# EAGLE schematic Wuefelseite_1D (EAGLE 7.6.0)
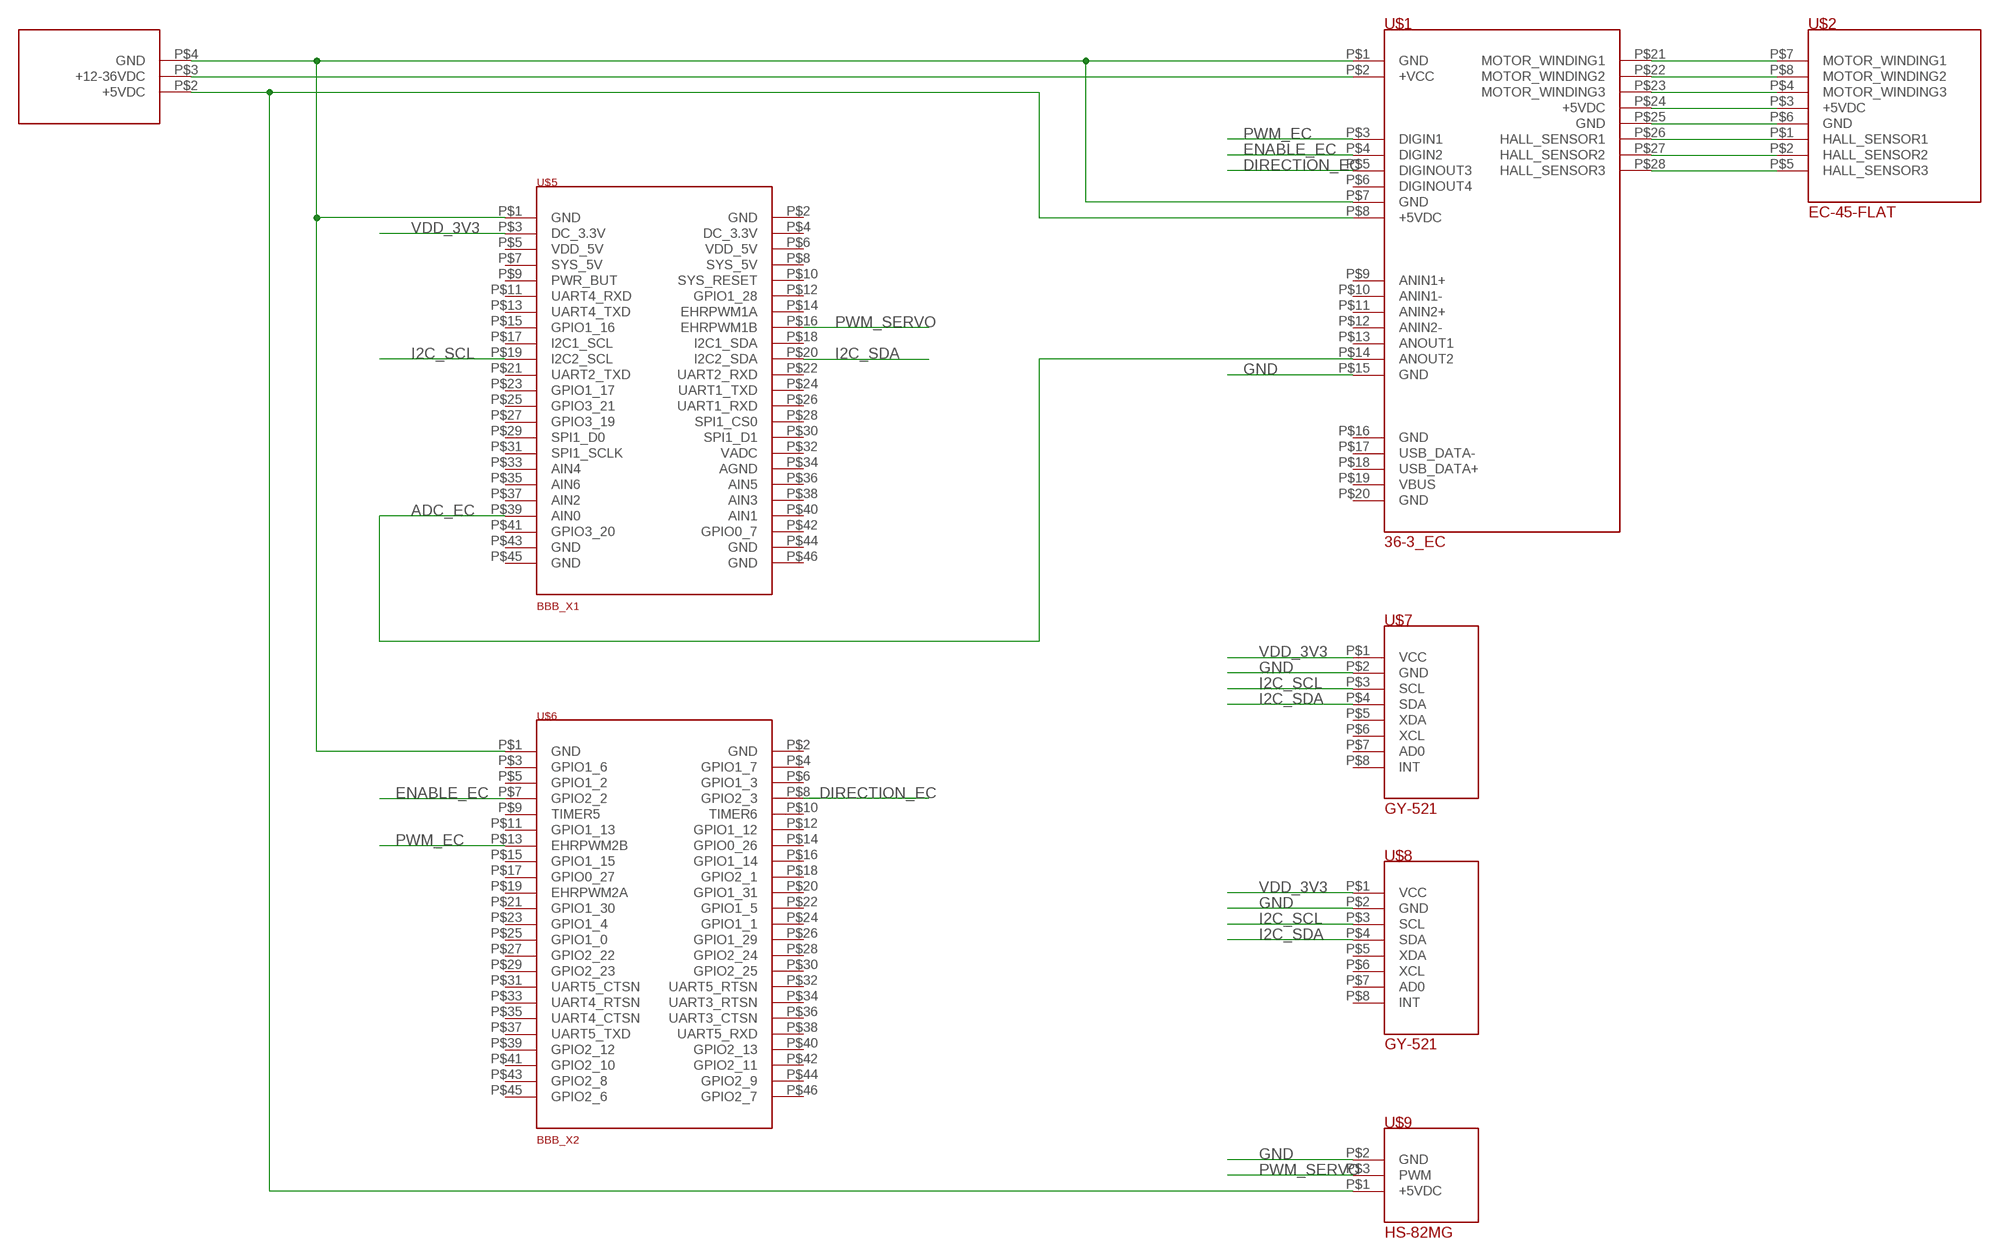
[diagram p0: schematic, sheet 1]

## Parts
U$1  36-3_EC  [36-3_EC]
U$2  EC-45-FLAT  [EC-45-FLAT]
U$5  BBB_X1  BEAGLEBONE  [BEAGLEBONE]
U$6  BBB_X2  BEAGLEBONE  [BEAGLEBONE]
U$7  GY-521  [GY-521]
U$8  GY-521  [GY-521]
U$9  HS-82MG  [HS-82MG]
U$10  POWER_SUPPLY  [POWER_SUPPLY]

## Nets
ADC_EC: U$1.P$14(ANOUT2) U$5.P$39(AIN0)
DIRECTION_EC: U$1.P$5(DIGINOUT3) U$6.P$8(GPIO2_3)
ENABLE_EC: U$1.P$4(DIGIN2) U$6.P$7(GPIO2_2)
GND: U$1.P$1(GND) U$1.P$7(GND) U$1.P$15(GND) U$5.P$1(GND) U$6.P$1(GND) U$7.P$2(GND) U$8.P$2(GND) U$9.P$2(GND) U$10.P$4(GND)
I2C_SCL: U$5.P$19(I2C2_SCL) U$7.P$3(SCL) U$8.P$3(SCL)
I2C_SDA: U$5.P$20(I2C2_SDA) U$7.P$4(SDA) U$8.P$4(SDA)
N$1: U$1.P$21(MOTOR_WINDING1) U$2.P$7(MOTOR_WINDING1)
N$2: U$1.P$22(MOTOR_WINDING2) U$2.P$8(MOTOR_WINDING2)
N$3: U$1.P$23(MOTOR_WINDING3) U$2.P$4(MOTOR_WINDING3)
N$4: U$1.P$24(+5VDC) U$2.P$3(+5VDC)
N$5: U$1.P$25(GND) U$2.P$6(GND)
N$6: U$1.P$26(HALL_SENSOR1) U$2.P$1(HALL_SENSOR1)
N$7: U$1.P$27(HALL_SENSOR2) U$2.P$2(HALL_SENSOR2)
N$8: U$1.P$28(HALL_SENSOR3) U$2.P$5(HALL_SENSOR3)
N$12: U$1.P$8(+5VDC) U$9.P$1(+5VDC) U$10.P$2(+5VDC)
N$18: U$1.P$2(+VCC) U$10.P$3(+12-36VDC)
PWM_EC: U$1.P$3(DIGIN1) U$6.P$13(EHRPWM2B)
PWM_SERVO: U$5.P$16(EHRPWM1B) U$9.P$3(PWM)
VDD_3V3: U$5.P$3(DC_3.3V) U$8.P$1(VCC)
Unconnected: U$1.P$6(DIGINOUT4) U$1.P$9(ANIN1+) U$1.P$10(ANIN1-) U$1.P$11(ANIN2+) U$1.P$12(ANIN2-) U$1.P$13(ANOUT1) U$1.P$16(GND) U$1.P$17(USB_DATA-) U$1.P$18(USB_DATA+) U$1.P$19(VBUS) U$1.P$20(GND) U$5.P$2(GND) U$5.P$4(DC_3.3V) U$5.P$5(VDD_5V) U$5.P$6(VDD_5V) U$5.P$7(SYS_5V) U$5.P$8(SYS_5V) U$5.P$9(PWR_BUT) U$5.P$10(SYS_RESET) U$5.P$11(UART4_RXD) U$5.P$12(GPIO1_28) U$5.P$13(UART4_TXD) U$5.P$14(EHRPWM1A) U$5.P$15(GPIO1_16) U$5.P$17(I2C1_SCL) U$5.P$18(I2C1_SDA) U$5.P$21(UART2_TXD) U$5.P$22(UART2_RXD) U$5.P$23(GPIO1_17) U$5.P$24(UART1_TXD) U$5.P$25(GPIO3_21) U$5.P$26(UART1_RXD) U$5.P$27(GPIO3_19) U$5.P$28(SPI1_CS0) U$5.P$29(SPI1_D0) U$5.P$30(SPI1_D1) U$5.P$31(SPI1_SCLK) U$5.P$32(VADC) U$5.P$33(AIN4) U$5.P$34(AGND) U$5.P$35(AIN6) U$5.P$36(AIN5) U$5.P$37(AIN2) U$5.P$38(AIN3) U$5.P$40(AIN1) U$5.P$41(GPIO3_20) U$5.P$42(GPIO0_7) U$5.P$43(GND) U$5.P$44(GND) U$5.P$45(GND) U$5.P$46(GND) U$6.P$2(GND) U$6.P$3(GPIO1_6) U$6.P$4(GPIO1_7) U$6.P$5(GPIO1_2) U$6.P$6(GPIO1_3) U$6.P$9(TIMER5) U$6.P$10(TIMER6) U$6.P$11(GPIO1_13) U$6.P$12(GPIO1_12) U$6.P$14(GPIO0_26) U$6.P$15(GPIO1_15) U$6.P$16(GPIO1_14) U$6.P$17(GPIO0_27) U$6.P$18(GPIO2_1) U$6.P$19(EHRPWM2A) U$6.P$20(GPIO1_31) U$6.P$21(GPIO1_30) U$6.P$22(GPIO1_5) U$6.P$23(GPIO1_4) U$6.P$24(GPIO1_1) U$6.P$25(GPIO1_0) U$6.P$26(GPIO1_29) U$6.P$27(GPIO2_22) U$6.P$28(GPIO2_24) U$6.P$29(GPIO2_23) U$6.P$30(GPIO2_25) U$6.P$31(UART5_CTSN) U$6.P$32(UART5_RTSN) U$6.P$33(UART4_RTSN) U$6.P$34(UART3_RTSN) U$6.P$35(UART4_CTSN) U$6.P$36(UART3_CTSN) U$6.P$37(UART5_TXD) U$6.P$38(UART5_RXD) U$6.P$39(GPIO2_12) U$6.P$40(GPIO2_13) U$6.P$41(GPIO2_10) U$6.P$42(GPIO2_11) U$6.P$43(GPIO2_8) U$6.P$44(GPIO2_9) U$6.P$45(GPIO2_6) U$6.P$46(GPIO2_7) U$7.P$1(VCC) U$7.P$5(XDA) U$7.P$6(XCL) U$7.P$7(AD0) U$7.P$8(INT) U$8.P$5(XDA) U$8.P$6(XCL) U$8.P$7(AD0) U$8.P$8(INT)

## Library data of the parts
U$1 = 36-3-EC:36-3_EC
U$2 = EC-45-flat:EC-45-FLAT
U$5 = BeagleBoneBlack:BEAGLEBONE
U$6 = BeagleBoneBlack2:BEAGLEBONE
U$7 U$8 = GY-521:GY-521
U$9 = HS-82MG:HS-82MG
U$10 = POWER_SUPPLY:POWER_SUPPLY